# Altium schematic sheet Sheet1.SchDoc
size 149 x 149 mm; SheetNumber: 1; SheetTotal: 1
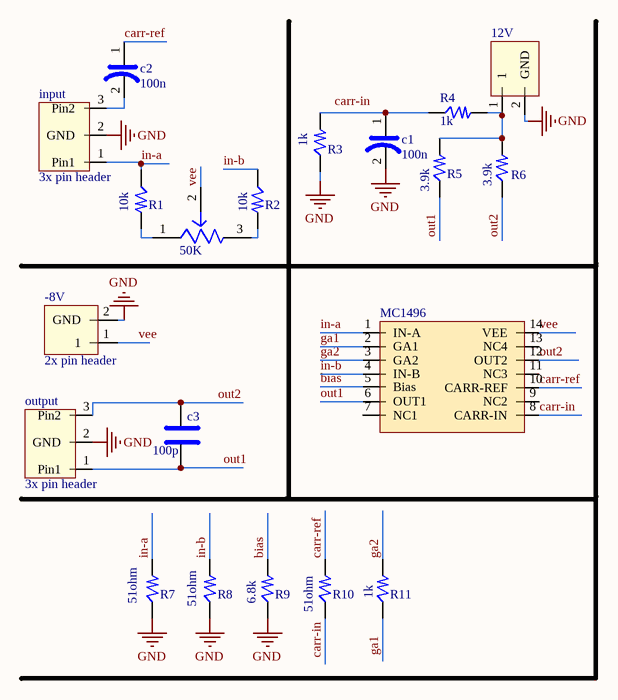
[diagram p0: Sheet1.SchDoc]

## Parts
12V  2x pin header  [2x pin header]  (value not drawn)
50K  3296 potenciometer  [3296 potenciometer]  (value not drawn)
-8V  2x pin header  [2x pin header]
c1  100n  [100n cap]
c2  100n  [100n cap]
c3  100p  [100p capacitor]
input  3x pin header  [3x pin header]
MC1496  MC1496.PP  [DIP-14-7.62mm]  (value not drawn)
output  3x pin header  [3x pin header]
R1  10k  [R_AXIAL_0.25W]
R2  10k  [R_AXIAL_0.25W]
R3  1k  [R_AXIAL_0.25W]
R4  1k  [R_AXIAL_0.25W]
R5  3.9k  [R_AXIAL_0.25W]
R6  3.9k  [R_AXIAL_0.25W]
R7  51ohm  [R_AXIAL_0.25W]
R8  51ohm  [R_AXIAL_0.25W]
R9  6.8k  [R_AXIAL_0.25W]
R10  51ohm  [R_AXIAL_0.25W]
R11  1k  [R_AXIAL_0.25W]

## Nets
GND: 12V.2(GND) -8V.2(GND) c1.2 input.2(GND) output.2(GND) R3.1 R7.1 R8.1 R9.1
bias: MC1496.5(Bias) R9.2
carr-in: MC1496.8(CARR-IN) R10.1
carr-ref: c2.1 MC1496.10(CARR-REF) R10.2
ga1: MC1496.2(GA1) R11.1
ga2: MC1496.3(GA2) R11.2
in-a: input.1(Pin1) MC1496.1(IN-A) R1.1 R7.2
in-b: MC1496.4(IN-B) R2.1 R8.2
out1: c3.2 MC1496.6(OUT1) output.1(Pin1) R5.1
out2: c3.1 MC1496.12(OUT2) output.3(Pin2) R6.1
vee: 50K.2 -8V.1 MC1496.14(VEE)
Net12V_1: 12V.1 R4.2 R5.2 R6.2
Net50K_1: 50K.1 R1.2
Net50K_3: 50K.3 R2.2
Netc1_1: c1.1 R3.2 R4.1
Netc2_2: c2.2 input.3(Pin2)

Not connected (* = marked no-connect by the designer): MC1496 7(NC1) 9(NC2) 11(NC3) 13(NC4)

## Notes on the sheet
- Labels drawn without touching a wire or pin: carr-in

## Library data of the parts
c1 c2 = 100n capacitor
c3 = 100p capacitor
MC1496 = MC1496.Dipp
R1-R11 = RESISTOR_Dipp